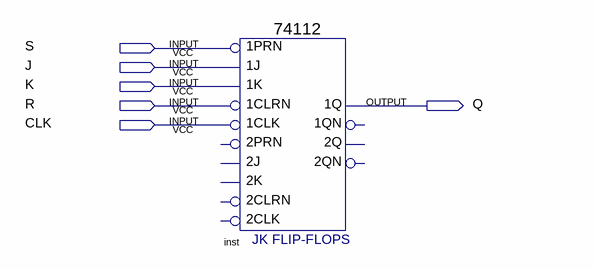
[diagram p0: schematic sheet]
// Quartus schematic pj603.bdf as structural Verilog: 1 symbols, 6 pins
module pj603 (
  input  S,
  input  J,
  input  K,
  input  R,
  input  CLK,
  output Q
);

  \74112  inst (
    .\1K (K), .\1J (J), .\1PRN (S), .\1CLK (CLK), .\1CLRN (R), .\1Q (Q));  // open: 2K, 2J, 2PRN, 2CLK, 2CLRN, 1QN, 2Q, 2QN
endmodule
